# Altium schematic sheet 05_SODIMM connector 2_3.SchDoc: C200
size 594 x 420 mm; Page Create Date: March  8, 1995; Page Number: 5; Page Size: A2; Comment: radxa_1010; Page Count: 21; RevCode: V1.11; Doc: 05_SODIMM connector 2_3; DsnPath: D:\WMS\C200\CC122\对外\C200 V1.11.DSN; SchematicName: c200; PageName: 05_SODIMM connector 2_3; PageSize: A2; TopSchematic: True
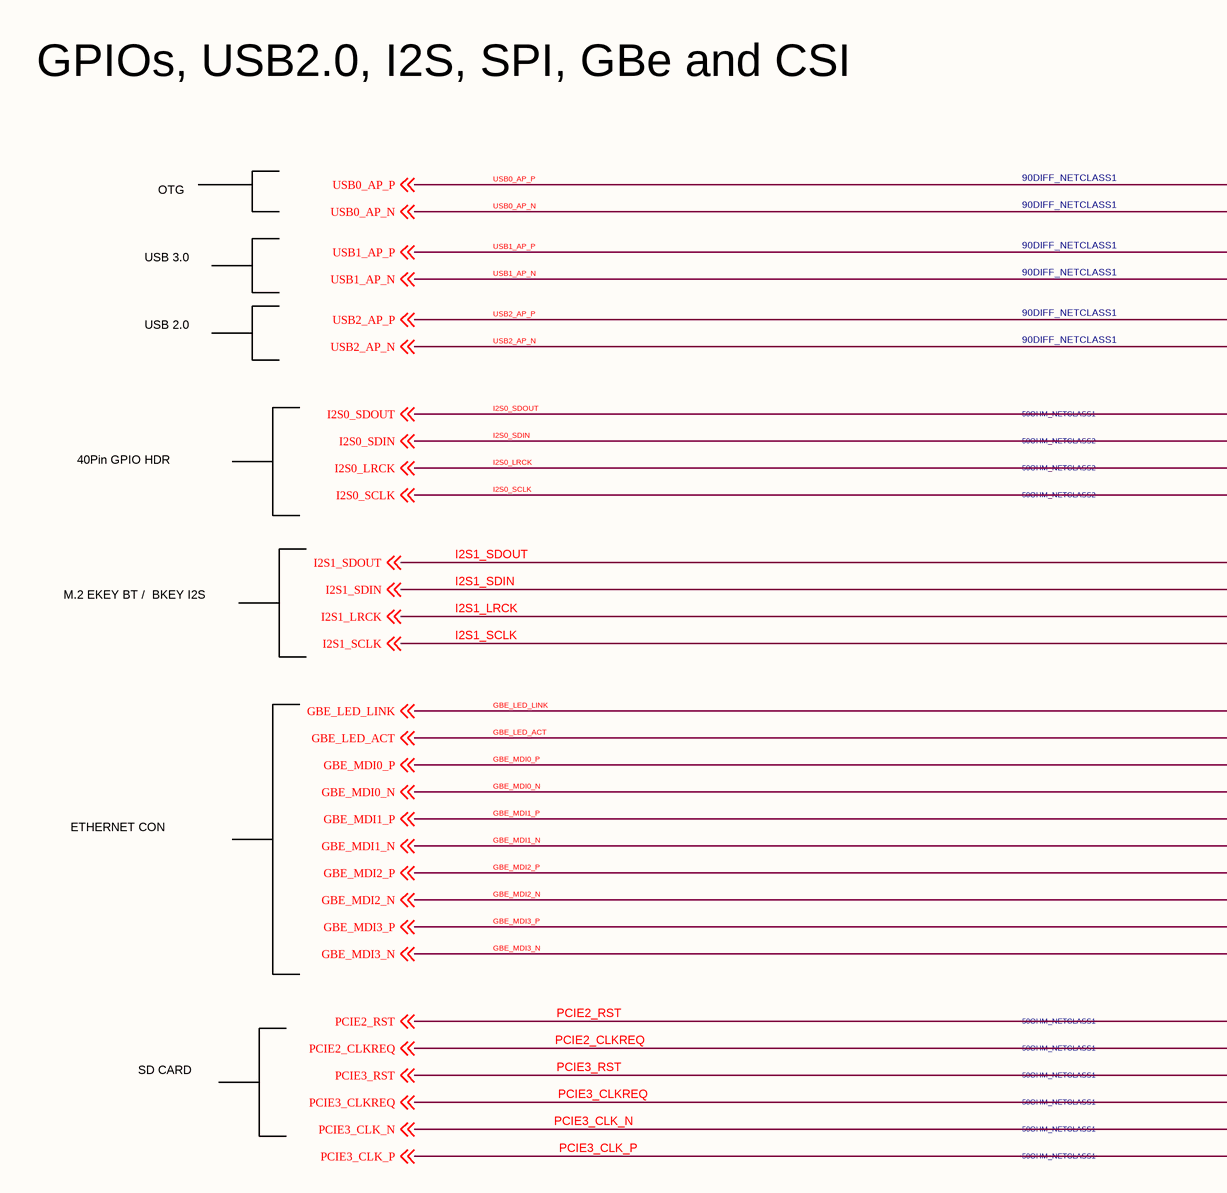
[diagram p0: 05_SODIMM connector 2_3.SchDoc, top left]
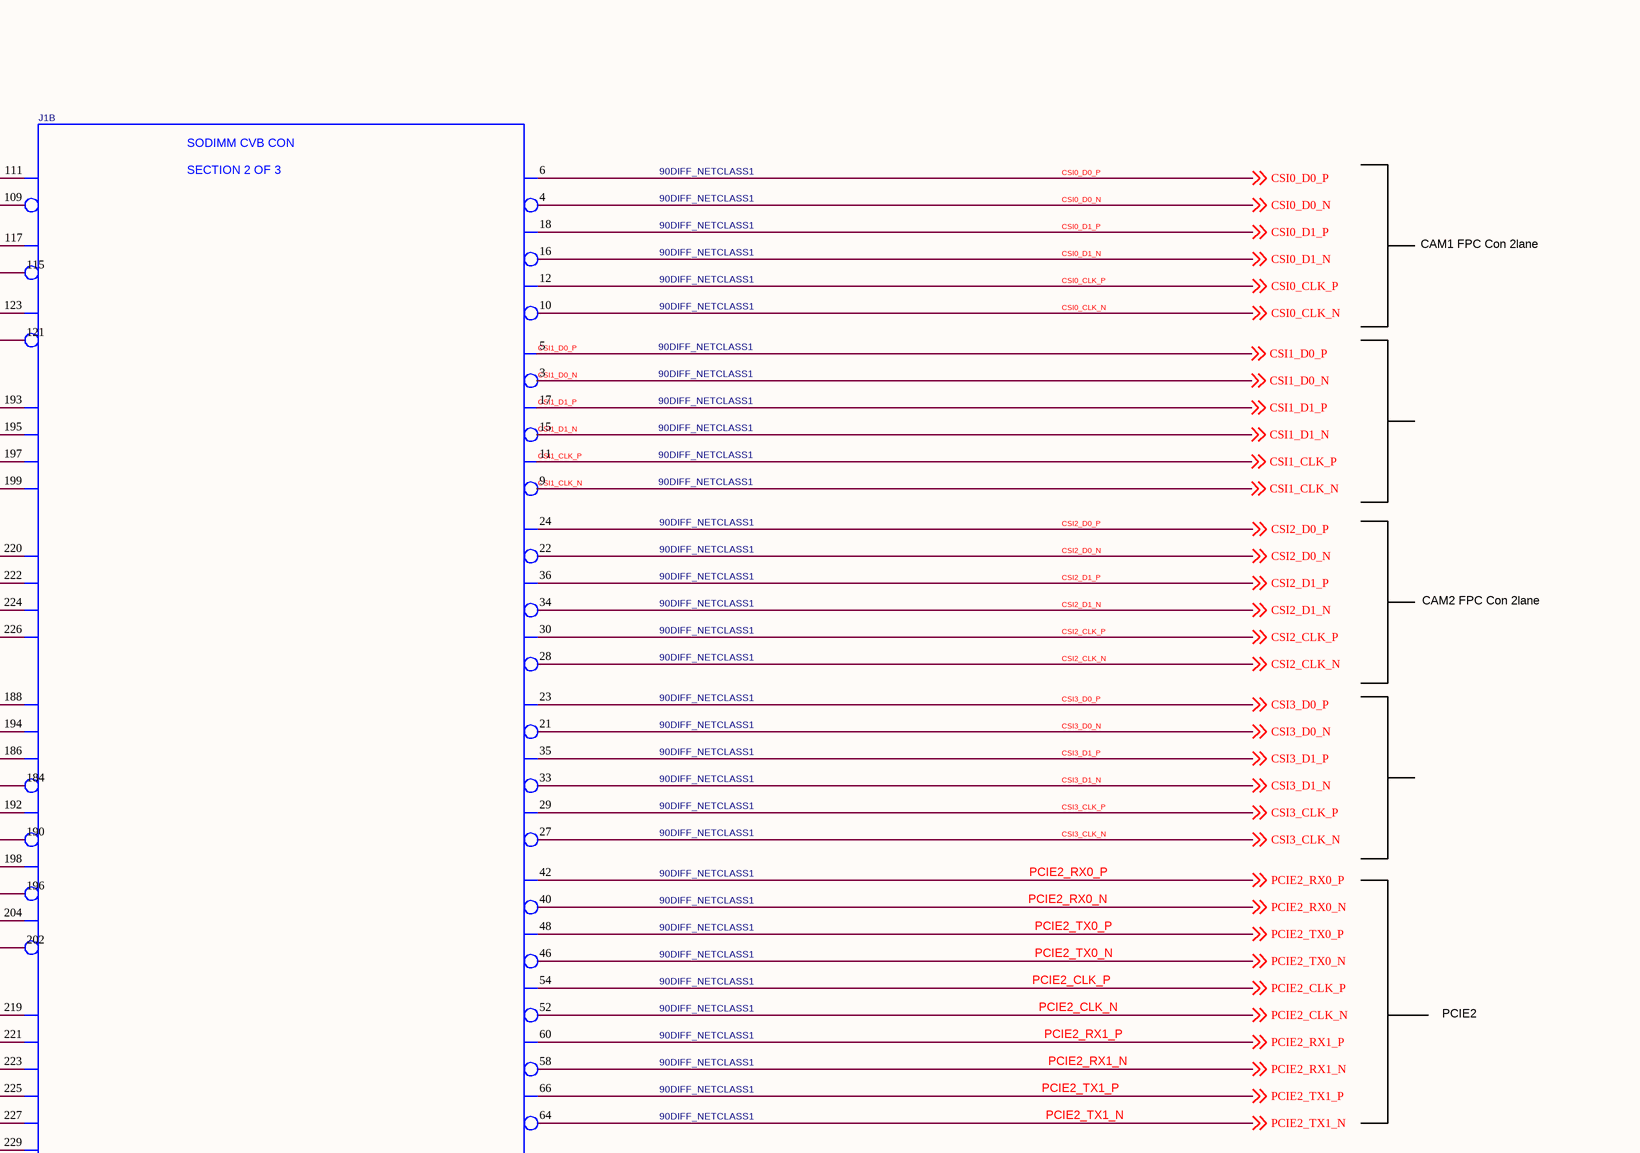
[diagram p1: 05_SODIMM connector 2_3.SchDoc, top right]
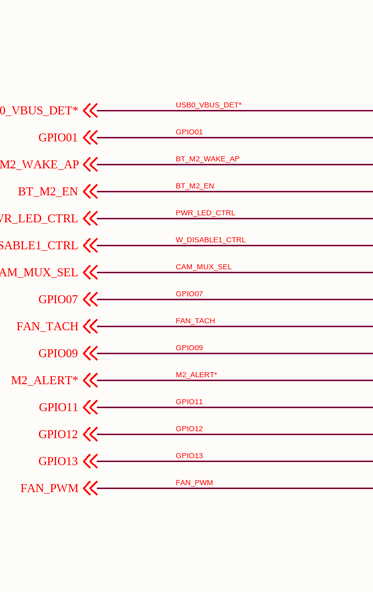
[diagram p2: 05_SODIMM connector 2_3.SchDoc, bottom left]
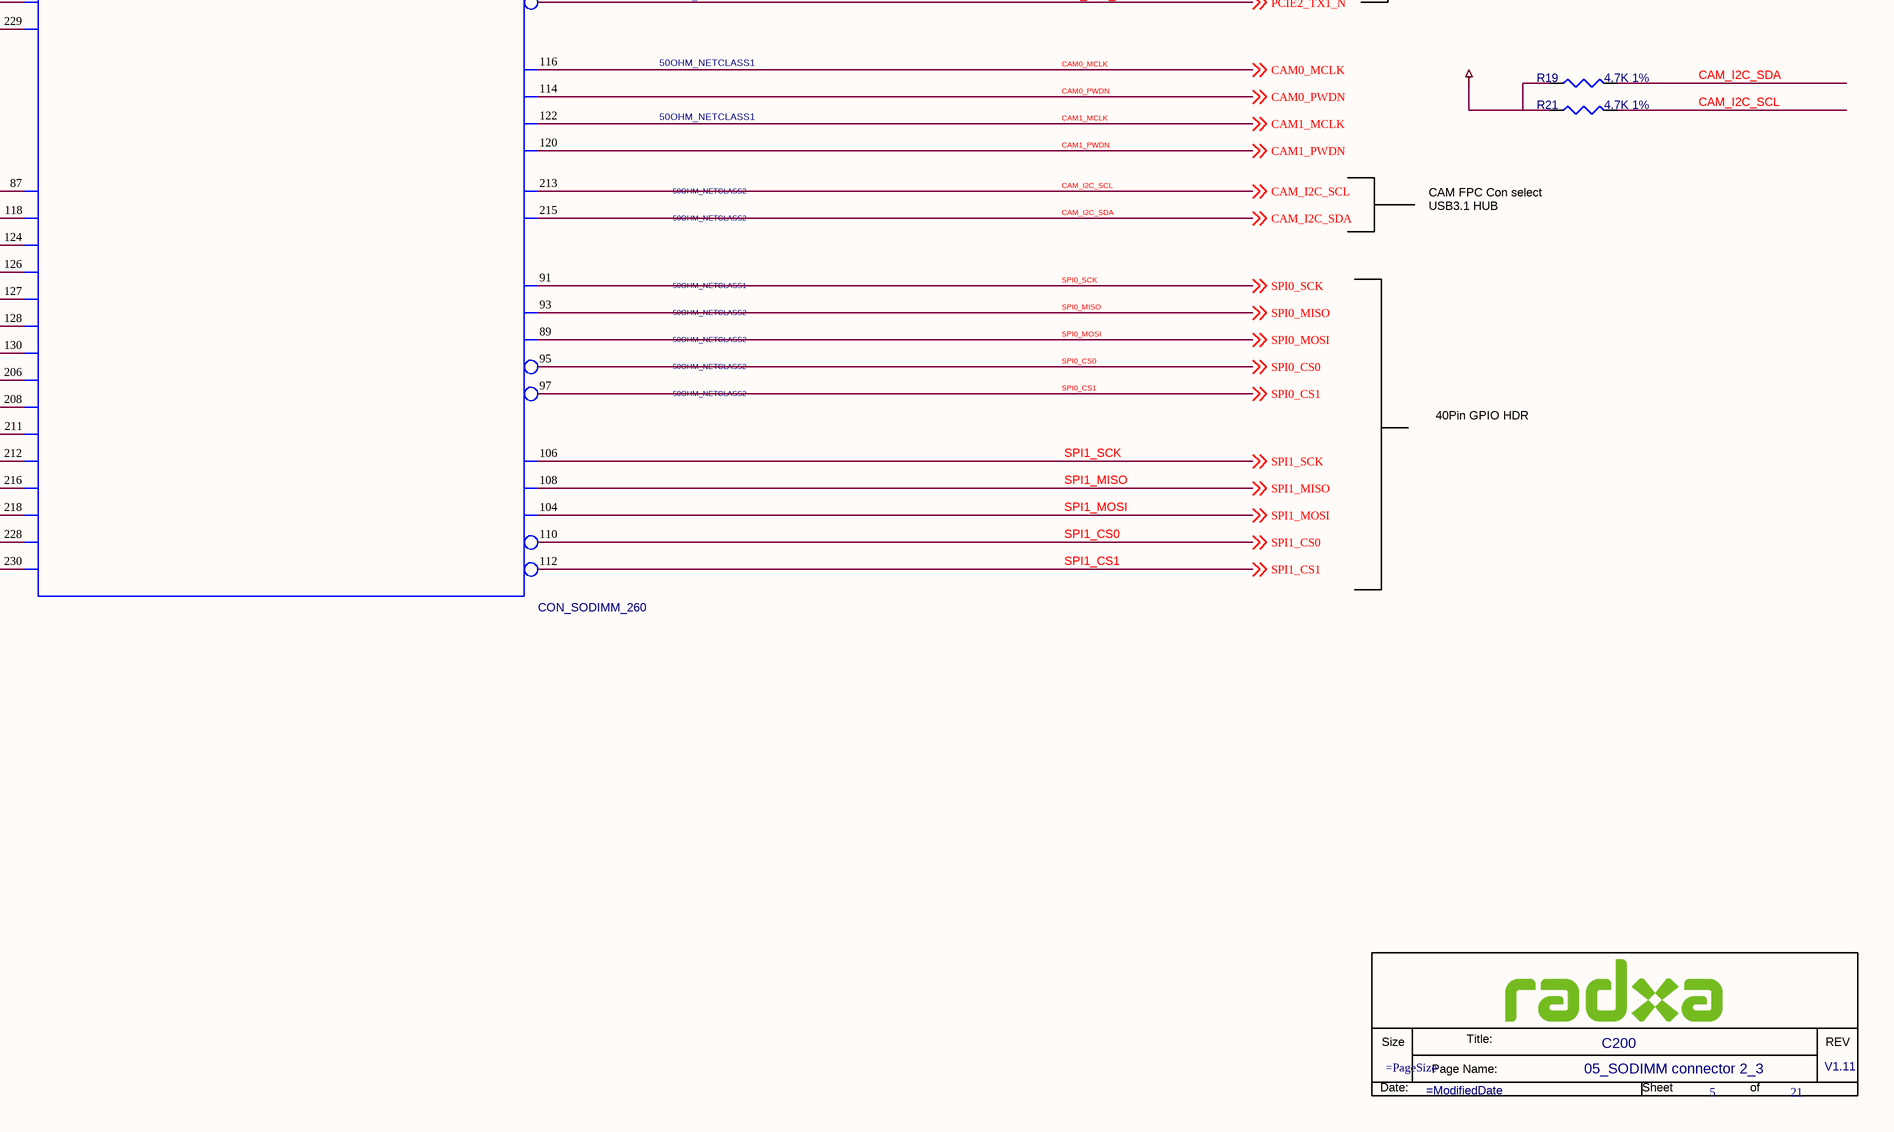
[diagram p3: 05_SODIMM connector 2_3.SchDoc, bottom right]

## Parts
*  Doc: 05_SODIMM connector 2_3  RevCode: V1.11  Title: C200  Page Number: 5  Page Count: 21  (hidden comment: radxa_1010)  (graphical)
J1  CON_SODIMM_260  [SODIMM_SM260_0D5_78D0X26D1]  (part B of 3)
R19  4.7K 1%  [R0402]
R21  4.7K 1%  [R0402]

## Nets
VDD_3V3_SYS: R19.1 R21.1
BT_M2_EN: J1.126(GPS_EN) ; off-sheet BT_M2_EN
BT_M2_WAKE_AP: J1.124(GPIO_PH6) ; off-sheet BT_M2_WAKE_AP
CAM0_MCLK: J1.116(CAM1_MCLK) ; off-sheet CAM0_MCLK
CAM0_PWDN: J1.114(CAM1_PWDN) ; off-sheet CAM0_PWDN
CAM1_MCLK: J1.122(CAM2_MCLK) ; off-sheet CAM1_MCLK
CAM1_PWDN: J1.120(CAM2_PWDN) ; off-sheet CAM1_PWDN
CAM_I2C_SCL: J1.213(CAM_I2C_SCL) R21.2 ; off-sheet CAM_I2C_SCL
CAM_I2C_SDA: J1.215(CAM_I2C_SDA) R19.2 ; off-sheet CAM_I2C_SDA
CAM_MUX_SEL: J1.130(NFC_EN) ; off-sheet CAM_MUX_SEL
CSI0_CLK_N: J1.10(CSI_A_CLK_N) ; off-sheet CSI0_CLK_N
CSI0_CLK_P: J1.12(CSI_A_CLK_P) ; off-sheet CSI0_CLK_P
CSI0_D0_N: J1.4(CSI_A_D0_N) ; off-sheet CSI0_D0_N
CSI0_D0_P: J1.6(CSI_A_D0_P) ; off-sheet CSI0_D0_P
CSI0_D1_N: J1.16(CSI_A_D1_N) ; off-sheet CSI0_D1_N
CSI0_D1_P: J1.18(CSI_A_D1_P) ; off-sheet CSI0_D1_P
CSI1_CLK_N: J1.9(CSI_B_CLK_N) ; off-sheet CSI1_CLK_N
CSI1_CLK_P: J1.11(CSI_B_CLK_P) ; off-sheet CSI1_CLK_P
CSI1_D0_N: J1.3(CSI_B_D0_N) ; off-sheet CSI1_D0_N
CSI1_D0_P: J1.5(CSI_B_D0_P) ; off-sheet CSI1_D0_P
CSI1_D1_N: J1.15(CSI_B_D1_N) ; off-sheet CSI1_D1_N
CSI1_D1_P: J1.17(CSI_B_D1_P) ; off-sheet CSI1_D1_P
CSI2_CLK_N: J1.28(CSI_E_CLK_N) ; off-sheet CSI2_CLK_N
CSI2_CLK_P: J1.30(CSI_E_CLK_P) ; off-sheet CSI2_CLK_P
CSI2_D0_N: J1.22(CSI_E_D0_N) ; off-sheet CSI2_D0_N
CSI2_D0_P: J1.24(CSI_E_D0_P) ; off-sheet CSI2_D0_P
CSI2_D1_N: J1.34(CSI_E_D1_N) ; off-sheet CSI2_D1_N
CSI2_D1_P: J1.36(CSI_E_D1_P) ; off-sheet CSI2_D1_P
CSI3_CLK_N: J1.27(CSI_F_CLK_N) ; off-sheet CSI3_CLK_N
CSI3_CLK_P: J1.29(CSI_F_CLK_P) ; off-sheet CSI3_CLK_P
CSI3_D0_N: J1.21(CSI_F_D0_N) ; off-sheet CSI3_D0_N
CSI3_D0_P: J1.23(CSI_F_D0_P) ; off-sheet CSI3_D0_P
CSI3_D1_N: J1.33(CSI_F_D1_N) ; off-sheet CSI3_D1_N
CSI3_D1_P: J1.35(CSI_F_D1_P) ; off-sheet CSI3_D1_P
FAN_PWM: J1.230(GPIO_PE7) ; off-sheet FAN_PWM
FAN_TACH: J1.208(GPIO_PZ2) ; off-sheet FAN_TACH
GBE_LED_ACT: J1.194(GBE_LED1) ; off-sheet GBE_LED_ACT
GBE_LED_LINK: J1.188(GBE_LED0) ; off-sheet GBE_LED_LINK
GBE_MDI0_N: J1.184(GBE_MDI0_N) ; off-sheet GBE_MDI0_N
GBE_MDI0_P: J1.186(GBE_MDI0_P) ; off-sheet GBE_MDI0_P
GBE_MDI1_N: J1.190(GBE_MDI1_N) ; off-sheet GBE_MDI1_N
GBE_MDI1_P: J1.192(GBE_MDI1_P) ; off-sheet GBE_MDI1_P
GBE_MDI2_N: J1.196(GBE_MDI2_N) ; off-sheet GBE_MDI2_N
GBE_MDI2_P: J1.198(GBE_MDI2_P) ; off-sheet GBE_MDI2_P
GBE_MDI3_N: J1.202(GBE_MDI3_N) ; off-sheet GBE_MDI3_N
GBE_MDI3_P: J1.204(GBE_MDI3_P) ; off-sheet GBE_MDI3_P
GPIO01: J1.118(CAM_AF_EN) ; off-sheet GPIO01
GPIO07: J1.206(LCD_BL_PWM) ; off-sheet GPIO07
GPIO09: J1.211(AUD_MCLK) ; off-sheet GPIO09
GPIO11: J1.216(GPIO_PZ0) ; off-sheet GPIO11
GPIO12: J1.218(LCD_TE) ; off-sheet GPIO12
GPIO13: J1.228(GPIO_PE6) ; off-sheet GPIO13
I2S0_LRCK: J1.197(DAP4_FS) ; off-sheet I2S0_LRCK
I2S0_SCLK: J1.199(DAP4_SCLK) ; off-sheet I2S0_SCLK
I2S0_SDIN: J1.195(DAP4_DIN) ; off-sheet I2S0_SDIN
I2S0_SDOUT: J1.193(DAP4_DOUT) ; off-sheet I2S0_SDOUT
I2S1_LRCK: J1.224(DAP3_FS) ; off-sheet I2S1_LRCK
I2S1_SCLK: J1.226(DAP3_SCLK) ; off-sheet I2S1_SCLK
I2S1_SDIN: J1.222(DAP3_DIN) ; off-sheet I2S1_SDIN
I2S1_SDOUT: J1.220(DAP3_DOUT) ; off-sheet I2S1_SDOUT
M2_ALERT*: J1.212(LCD_BL_EN) ; off-sheet M2_ALERT*
PCIE2_CLK_N: J1.52(CSI_C_CLK_N) ; off-sheet PCIE2_CLK_N
PCIE2_CLK_P: J1.54(CSI_C_CLK_P) ; off-sheet PCIE2_CLK_P
PCIE2_CLKREQ: J1.221(SDMMC3_DAT1) ; off-sheet PCIE2_CLKREQ
PCIE2_RST: J1.219(SDMMC3_DAT0) ; off-sheet PCIE2_RST
PCIE2_RX0_N: J1.40(CSI_D_D0_N) ; off-sheet PCIE2_RX0_N
PCIE2_RX0_P: J1.42(CSI_D_D0_P) ; off-sheet PCIE2_RX0_P
PCIE2_RX1_N: J1.58(CSI_C_D1_N) ; off-sheet PCIE2_RX1_N
PCIE2_RX1_P: J1.60(CSI_C_D1_P) ; off-sheet PCIE2_RX1_P
PCIE2_TX0_N: J1.46(CSI_C_D0_N) ; off-sheet PCIE2_TX0_N
PCIE2_TX0_P: J1.48(CSI_C_D0_P) ; off-sheet PCIE2_TX0_P
PCIE2_TX1_N: J1.64(CSI_D_D1_N) ; off-sheet PCIE2_TX1_N
PCIE2_TX1_P: J1.66(CSI_D_D1_P) ; off-sheet PCIE2_TX1_P
PCIE3_CLK_N: J1.227(SDMMC3_CMD) ; off-sheet PCIE3_CLK_N
PCIE3_CLK_P: J1.229(SDMMC3_CLK) ; off-sheet PCIE3_CLK_P
PCIE3_CLKREQ: J1.225(SDMMC3_DAT3) ; off-sheet PCIE3_CLKREQ
PCIE3_RST: J1.223(SDMMC3_DAT2) ; off-sheet PCIE3_RST
PWR_LED_CTRL: J1.127(NFC_INT) ; off-sheet PWR_LED_CTRL
SPI0_CS0: J1.95(SPI1_CS0) ; off-sheet SPI0_CS0
SPI0_CS1: J1.97(SPI1_CS1) ; off-sheet SPI0_CS1
SPI0_MISO: J1.93(SPI1_MISO) ; off-sheet SPI0_MISO
SPI0_MOSI: J1.89(SPI1_MOSI) ; off-sheet SPI0_MOSI
SPI0_SCK: J1.91(SPI1_SCK) ; off-sheet SPI0_SCK
SPI1_CS0: J1.110(SPI2_CS0) ; off-sheet SPI1_CS0
SPI1_CS1: J1.112(SPI2_CS1) ; off-sheet SPI1_CS1
SPI1_MISO: J1.108(SPI2_MISO) ; off-sheet SPI1_MISO
SPI1_MOSI: J1.104(SPI2_MOSI) ; off-sheet SPI1_MOSI
SPI1_SCK: J1.106(SPI2_SCK) ; off-sheet SPI1_SCK
USB0_AP_N: J1.109(USB0_DN) ; off-sheet USB0_AP_N
USB0_AP_P: J1.111(USB0_DP) ; off-sheet USB0_AP_P
USB0_VBUS_DET*: J1.87(USB_VBUS_EN0) ; off-sheet USB0_VBUS_DET*
USB1_AP_N: J1.115(USB1_DN) ; off-sheet USB1_AP_N
USB1_AP_P: J1.117(USB1_DP) ; off-sheet USB1_AP_P
USB2_AP_N: J1.121(USB2_DN) ; off-sheet USB2_AP_N
USB2_AP_P: J1.123(USB2_DP) ; off-sheet USB2_AP_P
W_DISABLE1_CTRL: J1.128(AP_WAKE_NFC) ; off-sheet W_DISABLE1_CTRL

## Notes on the sheet
- GPIOs, USB2.0, I2S, SPI, GBe and CSI
- OTG
- 90DIFF_NETCLASS1
- USB 3.0
- CAM1 FPC Con 2lane
- USB 2.0
- 50OHM_NETCLASS1
- 40Pin GPIO HDR
- 50OHM_NETCLASS2
- M.2 EKEY BT /  BKEY I2S
- CAM2 FPC Con 2lane
- ETHERNET CON
- PCIE2
- SD CARD
- USB3.1 HUB
- CAM FPC Con select
- (in symbol CON_SODIMM_260, part B) SODIMM CVB CON; SECTION 2 OF 3
- (in symbol radxa_1010) Size; Title:; REV; Page Name:; Date:; Sheet; of

## Library data of the parts
J1 = CON_SODIMM_260: SMD  母座  立贴  0.5mm脚距  AS0AA826-EASB0-7H  Foxconn  ROHS; Part Reference: J1; Part Number: A1J01.00015; OriginalSymbolOrigin: (-950,2300); ANGLE: ?; ASSEMBLY: ?; EMI_GROUND_TAB: ?; GENDER: ?; LATCHING: ?; MAX_CURRENT: ?; MAX_VOLTAGE: ?; NV_NAME: ?; NV_PN: ?; PACK_TYPE: ?; PATH: ?; PITCH: ?; PLACEMENT_NOTE: ?; REFLOW: ?; SHIELDED: ?; SHROUDED: ?; SKU: COMMON; Value: CON_SODIMM_260; Part Type: 连接座; PCB Footprint: SODIMM_SM260_0D5_78D0X26D1
R19 = R: SMD  0402  4.7K  1/16W  ±1%  ROHS; Part Reference: R19; Part Number: A1R01.00250; PCB Footprint: R0402; Value: 4.7K 1%; Part Type: 贴片电阻
R21 = R: SMD  0402  4.7K  1/16W  ±1%  ROHS; Part Reference: R21; Part Number: A1R01.00250; PCB Footprint: R0402; Value: 4.7K 1%; Part Type: 贴片电阻
* = radxa_1010: Page Create Date: March  8, 1995; Page Size: =PageSize; Page Modify Date: =ModifiedDate